# EasyEDA Pro project H723_AD9280_AD9708.eprj

# Schematic Schematic1
Board Name: Board1; Create Date: 2024-12-18; Page Name: P1; Project Name: H723_AD9280_AD9708; Schematic Name: Schematic1; Update Date: 2024-12-18; Company: 嘉立创EDA; Page Size: A4; Version: V1.0
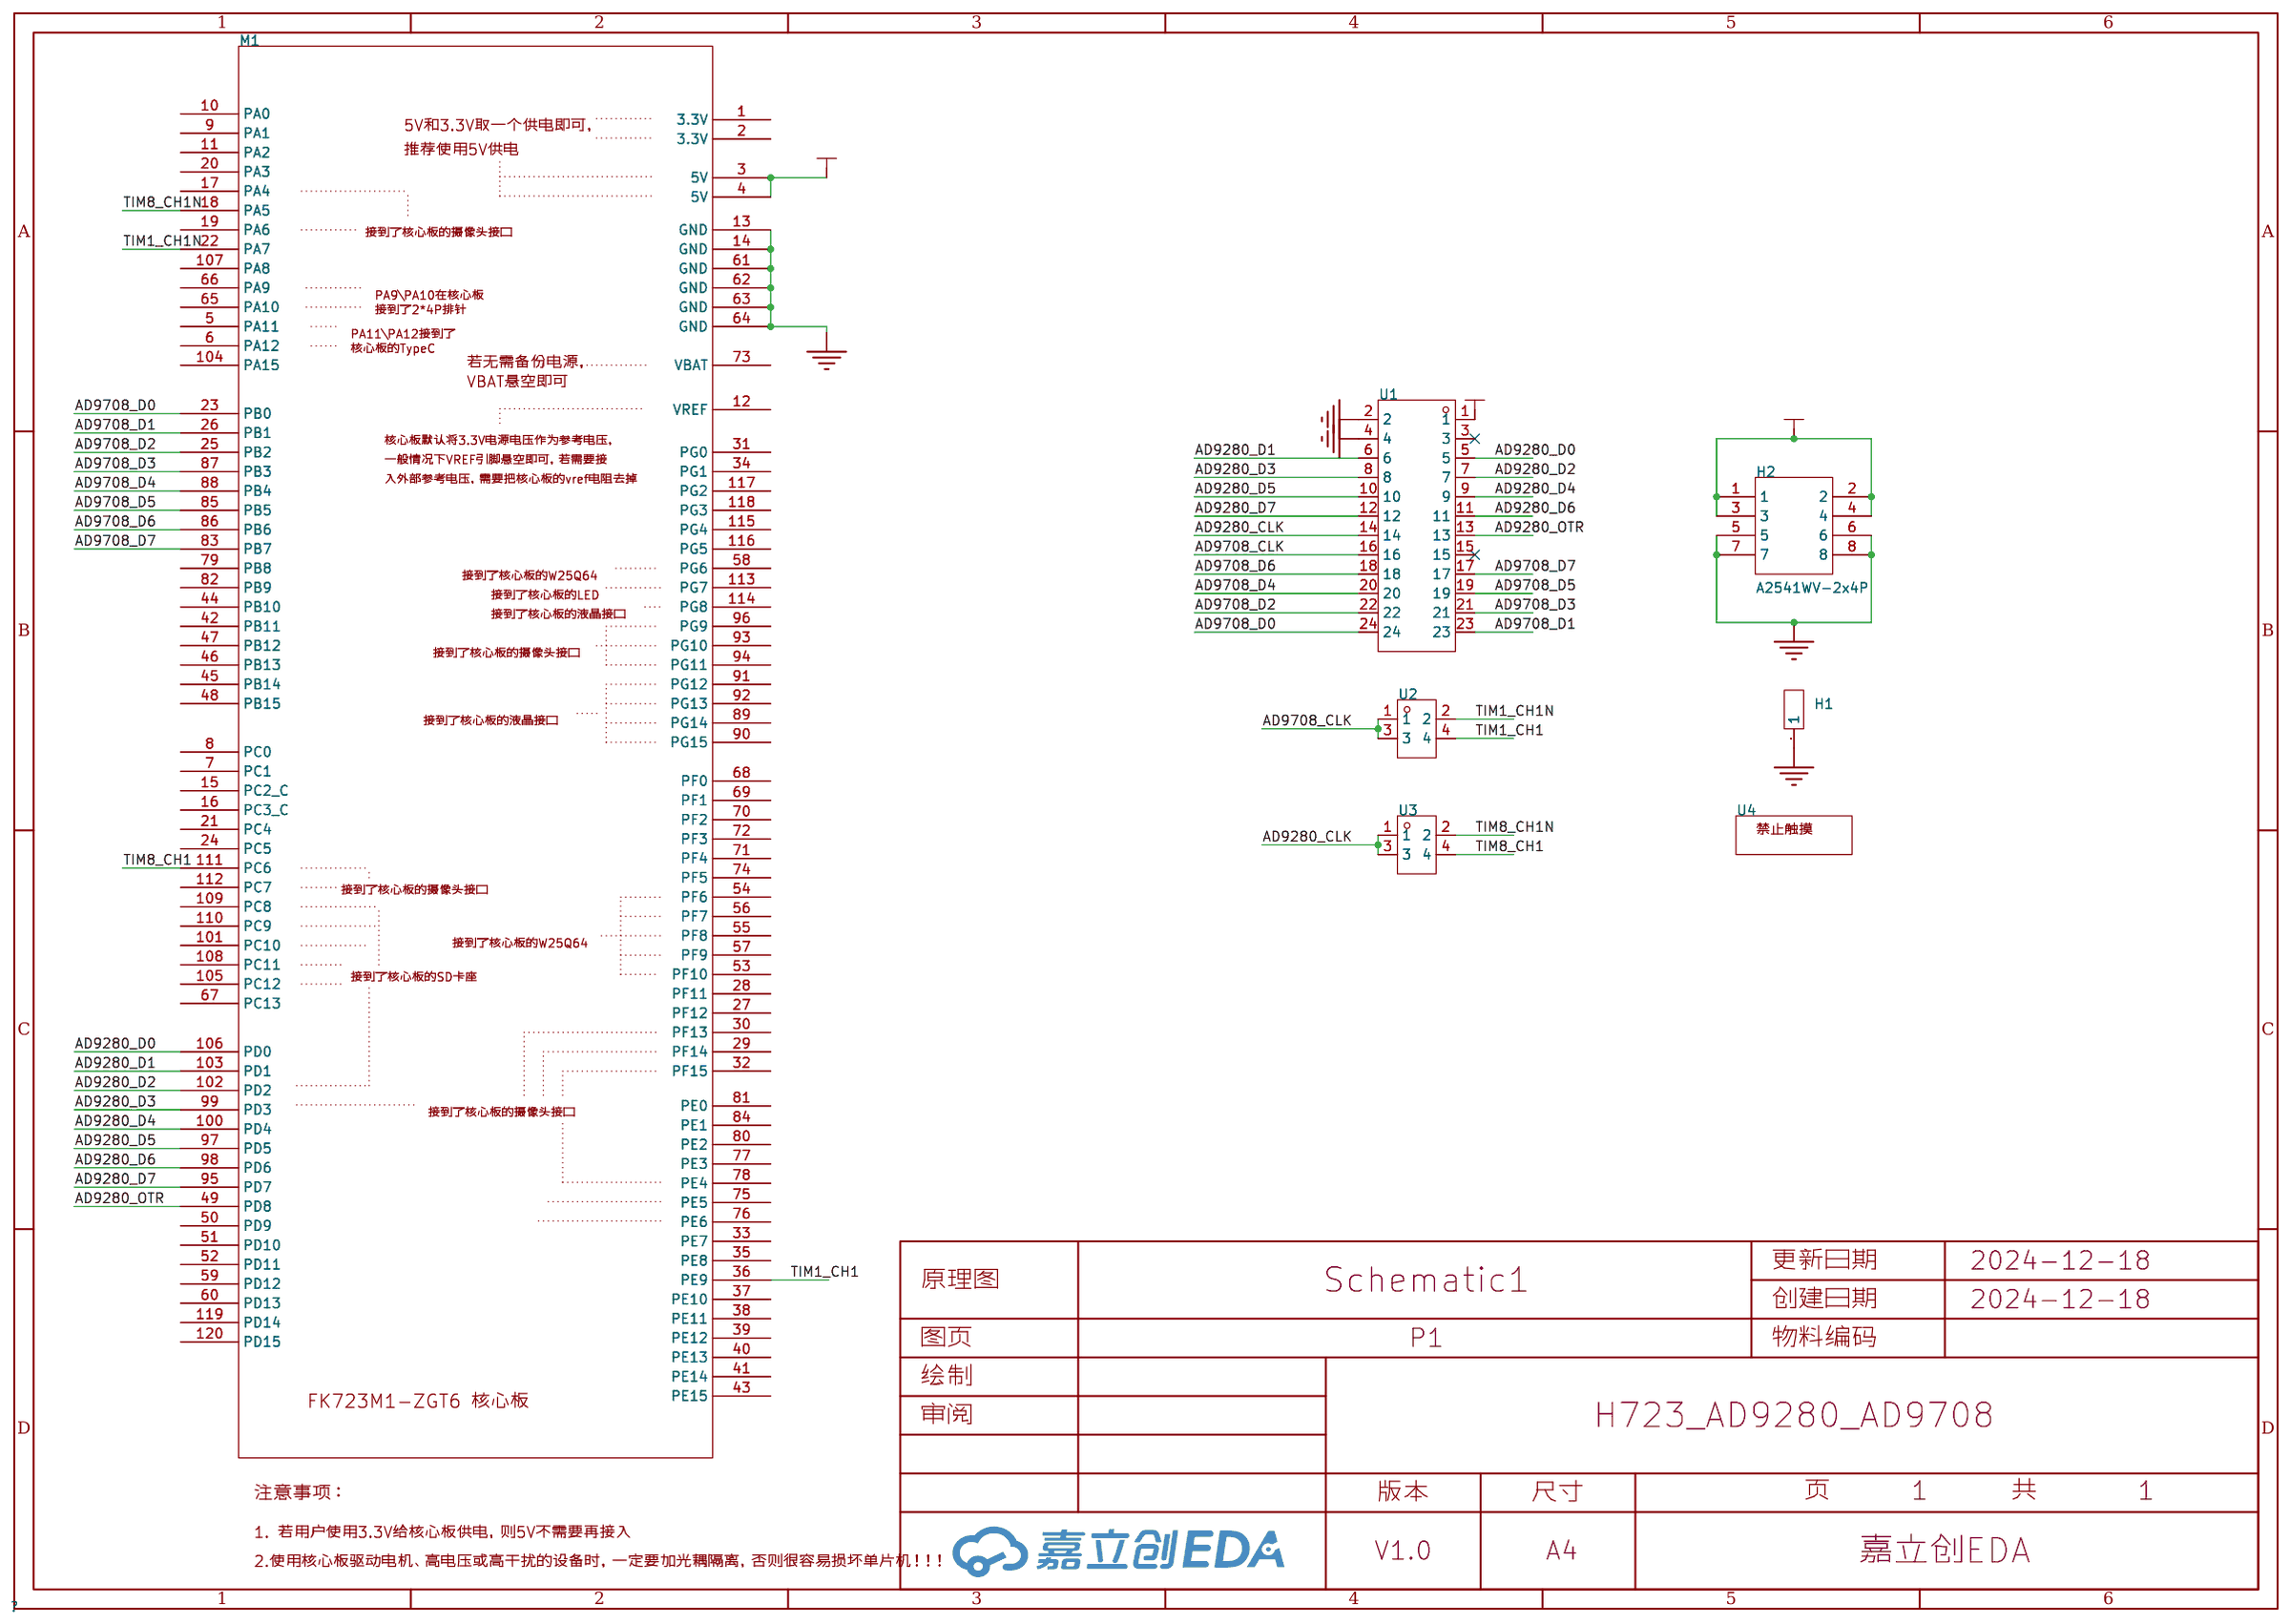
[diagram p0: schematic sheet]

## Parts
H1  -  [HDR-TH_1P-V-M_XKB_X4611WV-01I-C28D40]
H2  A2541WV-2x4P  [HDR-TH_8P-P2.54-V-R2-C4-S2.54_A2541WV-2X4P]
M1  -  [FK723M1-ZGT6]
U1  2541WV-2x12P  [HDR-TH_24P-P2.54-V-M-R2-C12-S2.54]
U2  2541WV-2x02P  [HDR-TH_4P-P2.54-V-M-R2-C2-S2.54]
U3  2541WV-2x02P  [HDR-TH_4P-P2.54-V-M-R2-C2-S2.54]
U4  -  [禁止触摸LOGO]

## Library data of the parts
H1 = HDR-M_2.54_1x1P: Supplier Part: C81276; Supplier Footprint: 插件; JLCPCB Part Class: Extended Part
H2 = A2541WV-2x4P: LCSC Part Name: 2x4P 间距:2.54mm 方针 直插; Supplier Part: C225519; Manufacturer: CJT(长江连接器); Supplier Footprint: 插件,P=2.54mm; JLCPCB Part Class: 扩展库; Datasheet: https://atta.szlcsc.com/upload/public/pdf/source/20180724/C239359_48B1BC0CA1B4E4396A63955AAFD15564.pdf; Supplier: LCSC; Pin Structure: 2x4P; Pitch: 2.54mm; Row Spacing: 2.54mm; Circluar Pins/Square Pins: 方针; Mounting Type: 直插; Number of Rows: 双排; Number of Pins: 8P; Current Rating (Max): 3A; Voltage Rating (Max): 250V; Length of Mating Pin: 6mm; Insulation Height: 2.54mm; Length of End Connection Pin: 3mm; Contact Material: 黄铜; Contact Plating: 金; Operating Temperature Range: -40℃~+105℃; Color: 黑色
M1 = FK723M1-ZGT6
U1 = 2541WV-2x12P: LCSC Part Name: 2x12P 间距:2.54mm 直插; Supplier Part: C5383110; Manufacturer: HanElectricity(瀚源); Supplier Footprint: 插件,P=2.54mm; JLCPCB Part Class: 扩展库; Datasheet: https://atta.szlcsc.com/upload/public/pdf/source/20230330/E6AE37B56C45D0CDA24B058754300644.pdf; Supplier: LCSC; Pin Structure: 2x12P; Pitch: 2.54mm; Mounting Type: 直插; Number of Rows: 双排; Number of Pins: 24P; Length of Mating Pin: 6mm; Insulation Height: 2.54mm; Length of End Connection Pin: 3mm
U2 U3 = 2541WV-2x02P: LCSC Part Name: 2x2P 间距:2.54mm 直插; Supplier Part: C5383103; Manufacturer: HanElectricity(瀚源); Supplier Footprint: 插件,P=2.54mm; JLCPCB Part Class: 扩展库; Datasheet: https://atta.szlcsc.com/upload/public/pdf/source/20230330/E6AE37B56C45D0CDA24B058754300644.pdf; Supplier: LCSC; Pin Structure: 2x2P; Pitch: 2.54mm; Mounting Type: 直插; Number of Rows: 双排; Number of Pins: 4P; Length of Mating Pin: 6mm; Insulation Height: 2.54mm; Length of End Connection Pin: 3mm
U4 = 禁止触摸LOGO

## Nets
5V: H2.1 H2.2 H2.3 H2.4 M1.3(5V) M1.4(5V) U1.1
GND: H1.1 H2.5 H2.6 H2.7 H2.8 M1.13(GND) M1.14(GND) M1.61(GND) M1.62(GND) M1.63(GND) M1.64(GND) U1.2 U1.4
AD9280_CLK: U1.14 U3.1 U3.3
AD9280_D0: M1.106(PD0) U1.5
AD9280_D1: M1.103(PD1) U1.6
AD9280_D2: M1.102(PD2) U1.7
AD9280_D3: M1.99(PD3) U1.8
AD9280_D4: M1.100(PD4) U1.9
AD9280_D5: M1.97(PD5) U1.10
AD9280_D6: M1.98(PD6) U1.11
AD9280_D7: M1.95(PD7) U1.12
AD9280_OTR: M1.49(PD8) U1.13
AD9708_CLK: U1.16 U2.1 U2.3
AD9708_D0: M1.23(PB0) U1.24
AD9708_D1: M1.26(PB1) U1.23
AD9708_D2: M1.25(PB2) U1.22
AD9708_D3: M1.87(PB3) U1.21
AD9708_D4: M1.88(PB4) U1.20
AD9708_D5: M1.85(PB5) U1.19
AD9708_D6: M1.86(PB6) U1.18
AD9708_D7: M1.83(PB7) U1.17
TIM1_CH1: M1.36(PE9) U2.4
TIM1_CH1N: M1.22(PA7) U2.2
TIM8_CH1: M1.111(PC6) U3.4
TIM8_CH1N: M1.18(PA5) U3.2

Not connected (* = marked no-connect by the designer): M1 1(3.3V) 2(3.3V) 5(PA11) 6(PA12) 7(PC1) 8(PC0) 9(PA1) 10(PA0) 11(PA2) 12(VREF) 15(PC2_C) 16(PC3_C) 17(PA4) 19(PA6) 20(PA3) 21(PC4) 24(PC5) 27(PF12) 28(PF11) 29(PF14) 30(PF13) 31(PG0) 32(PF15) 33(PE7) 34(PG1) 35(PE8) 37(PE10) 38(PE11) 39(PE12) 40(PE13) 41(PE14) 42(PB11) 43(PE15) 44(PB10) 45(PB14) 46(PB13) 47(PB12) 48(PB15) 50(PD9) 51(PD10) 52(PD11) 53(PF10) 54(PF6) 55(PF8) 56(PF7) 57(PF9) 58(PG6) 59(PD12) 60(PD13) 65(PA10) 66(PA9) 67(PC13) 68(PF0) 69(PF1) 70(PF2) 71(PF4) 72(PF3) 73(VBAT) 74(PF5) 75(PE5) 76(PE6) 77(PE3) 78(PE4) 79(PB8) 80(PE2) 81(PE0) 82(PB9) 84(PE1) 89(PG14) 90(PG15) 91(PG12) 92(PG13) 93(PG10) 94(PG11) 96(PG9) 101(PC10) 104(PA15) 105(PC12) 107(PA8) 108(PC11) 109(PC8) 110(PC9) 112(PC7) 113(PG7) 114(PG8) 115(PG4) 116(PG5) 117(PG2) 118(PG3) 119(PD14) 120(PD15); U1 3* 15*

# Board PCB1
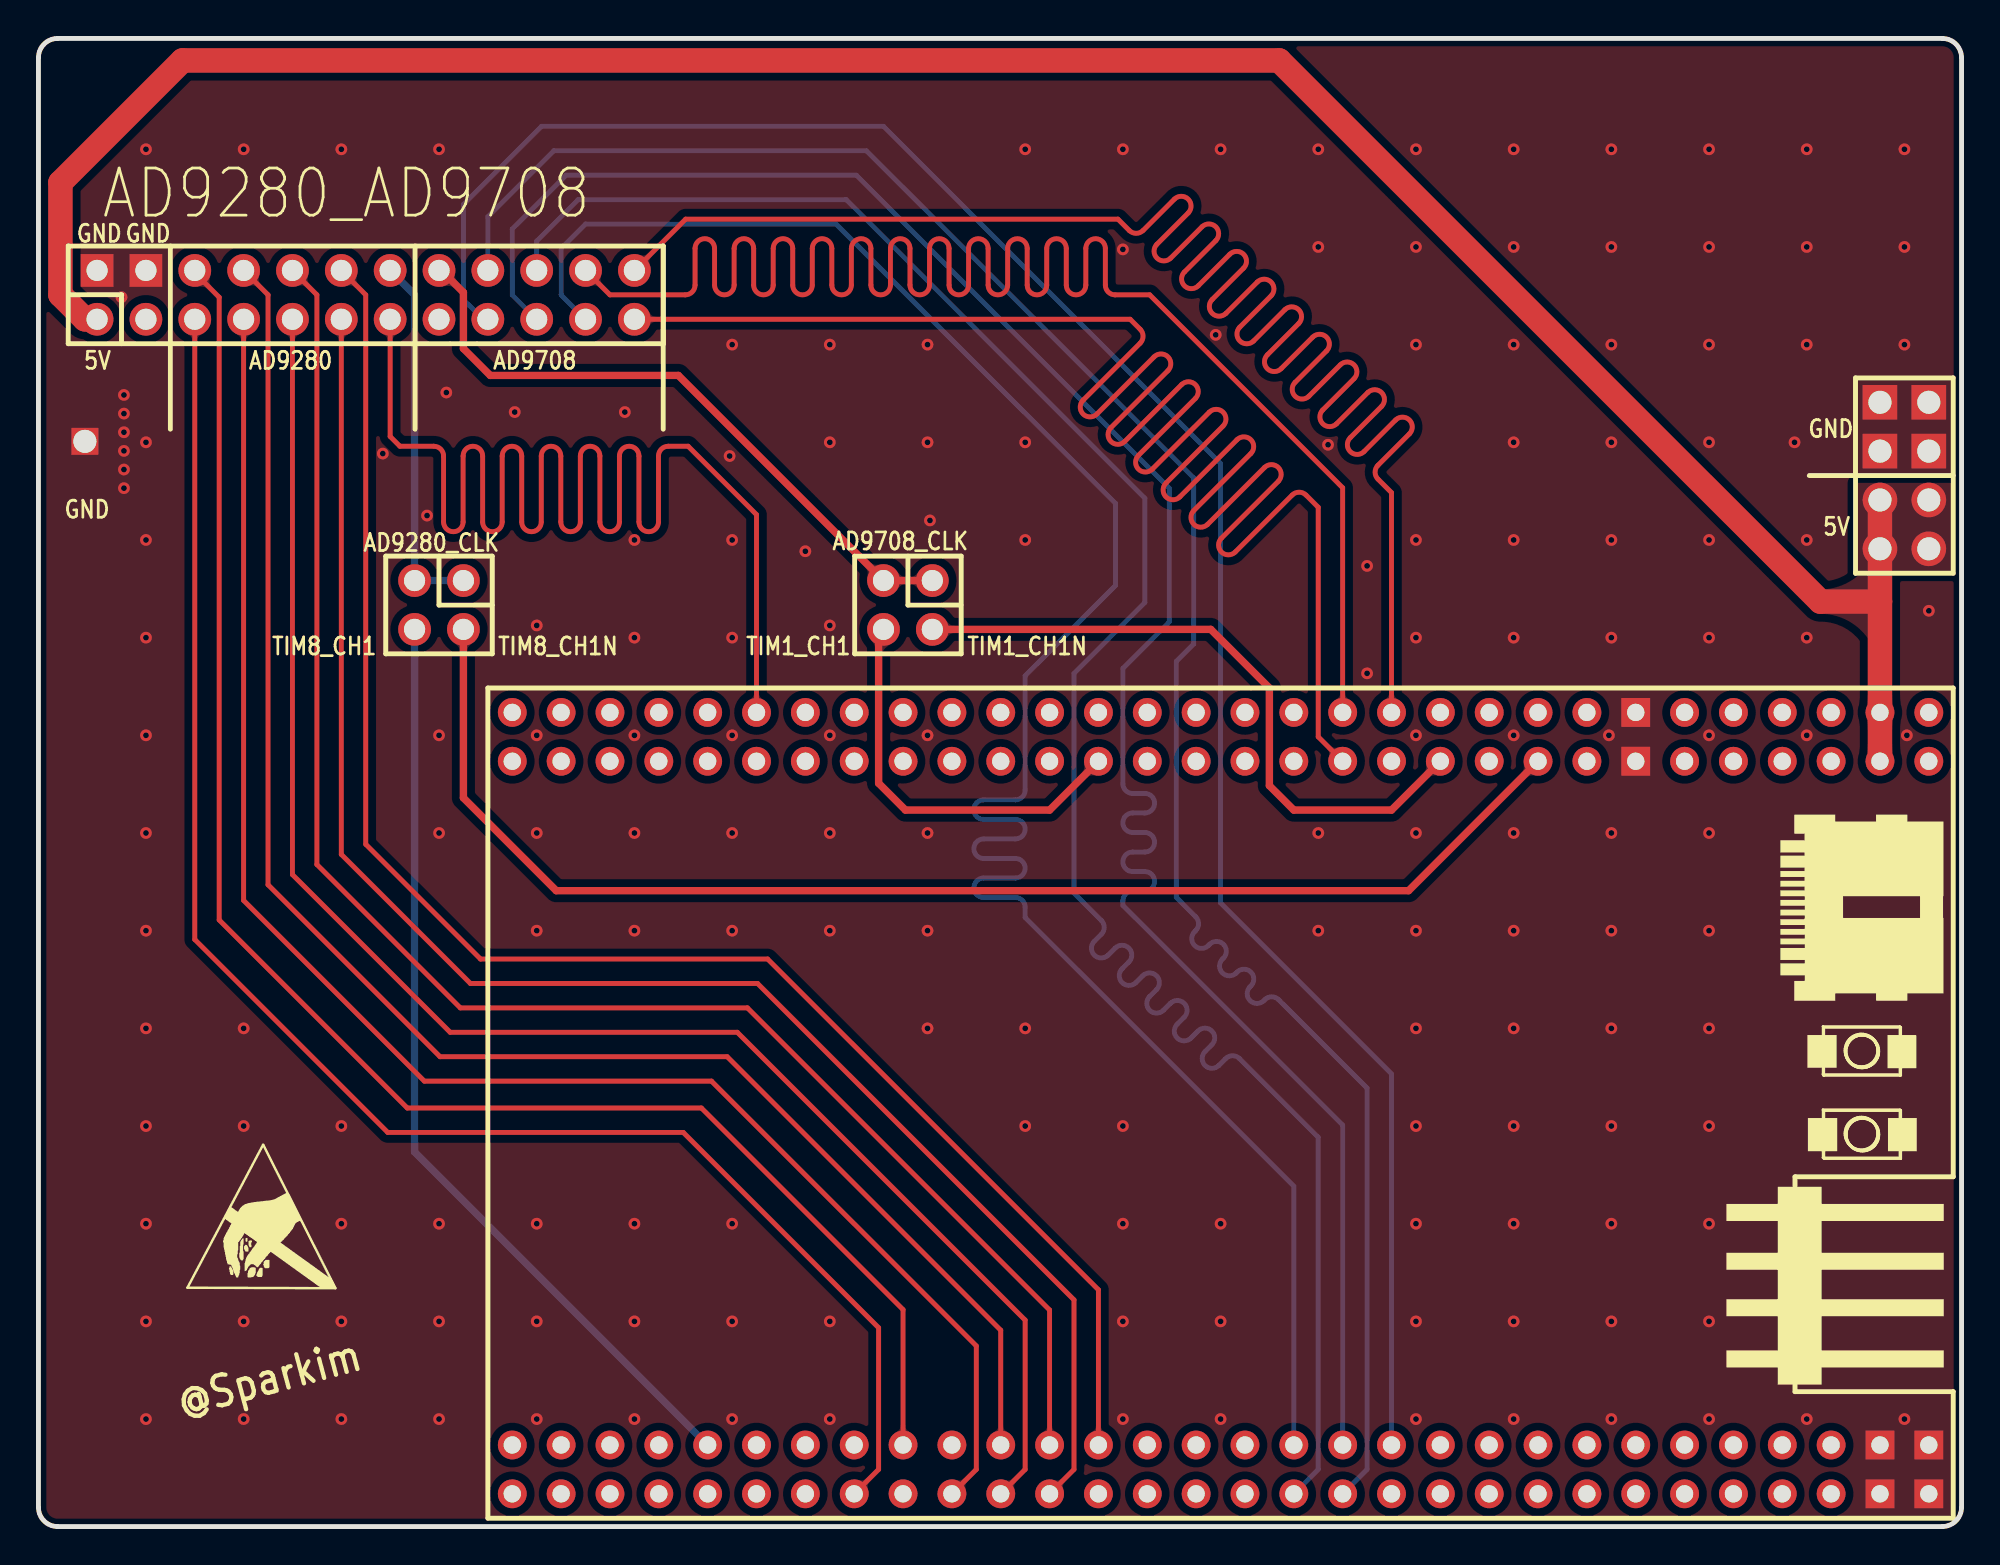
[diagram p1: board, top side]
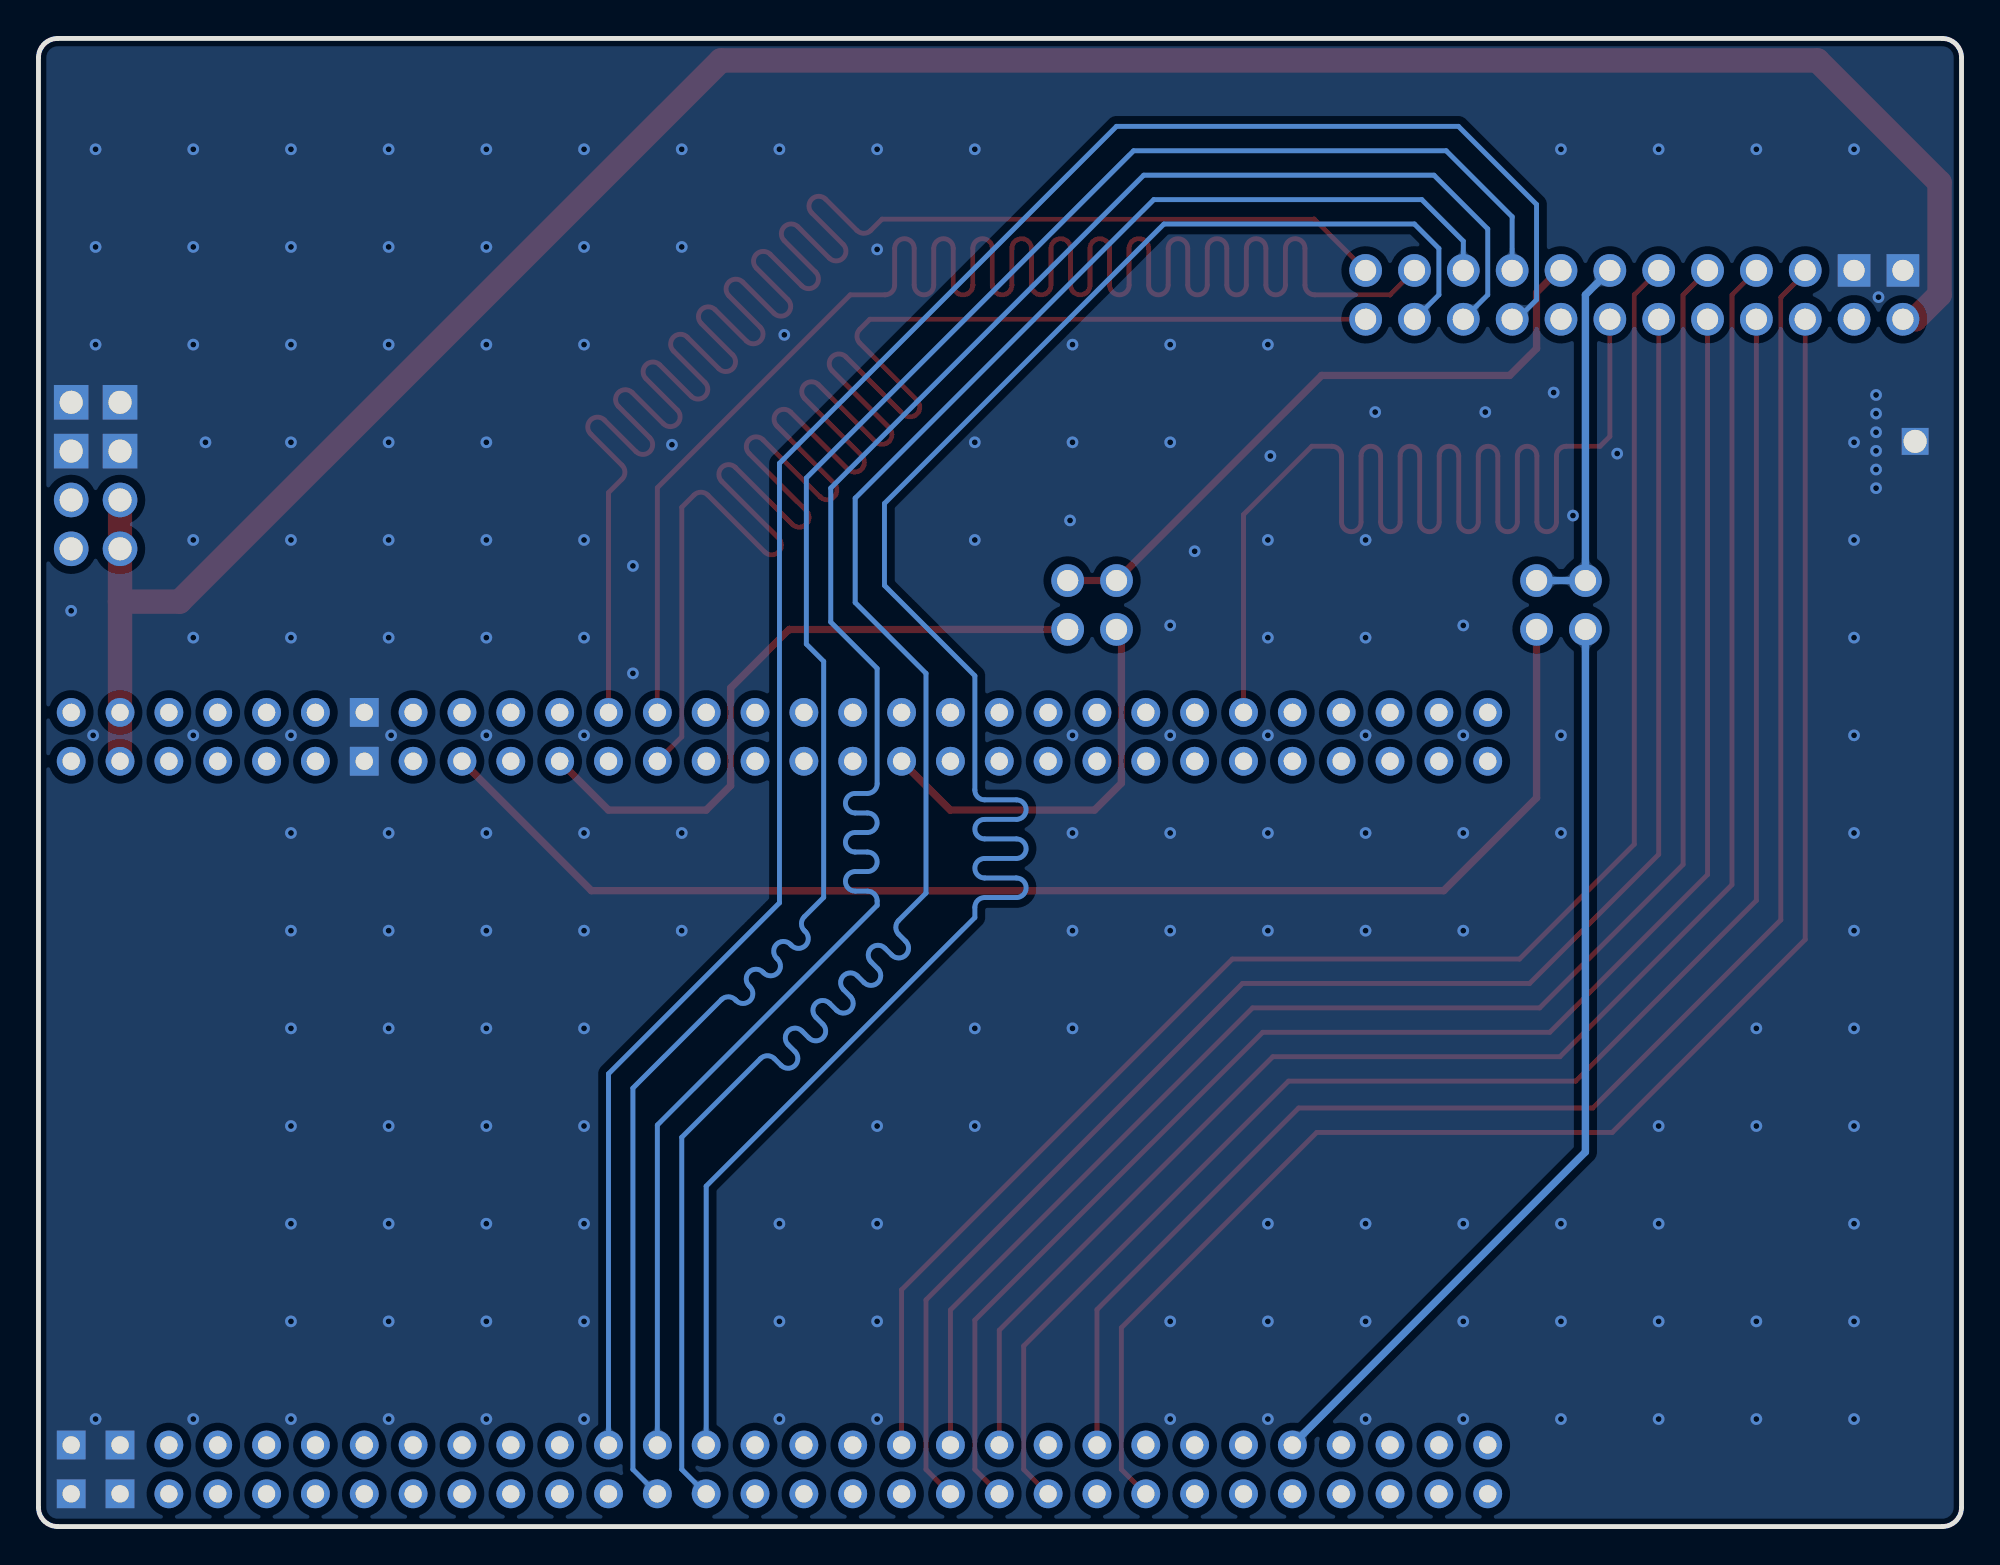
[diagram p2: board, bottom side, seen from below]

Outline 100 x 77.39 mm; copper layers: Top Layer, Bottom Layer. Coordinates in mm from the lower left corner of the outline.
Outline path: 0,76.39 0,1 arc(0.29,0.29) 1,0 99,0 arc(99.71,0.29) 100,1 100,76.39 arc(99.71,77.1) 99,77.39 1,77.39 arc(0.29,77.1) 0,76.39
Stack: Top Layer 0.035mm / Dielectric1 1.51mm FR4 er 4.5 / Bottom Layer 0.035mm

## Design rules (mm)
template: 自定义配置
spacing copperThickness1oz (default): track to track 0.102, other pairs 0.152 to 0.3
spacing copperThickness2oz: track to track 0.203, other pairs 0.152 to 0.3
track width copperThickness1oz (default): min 0.127, default 0.254, max 2.54
track width copperThickness2oz: min 0.203, default 0.254, max 2.54
differential pair differentialPair (default): width min 0.127, default 0.254, max 2.54; gap min 0.152, default 0.152
via viaSize (default): diameter min 0.5, default 0.61, max 10; hole min 0.3, default 0.305, max 6.299
net AD9708_D1 uses netLength2
net AD9708_D2 uses netLength2
net AD9708_D0 uses netLength2
net AD9280_OTR uses netLength1
net AD9708_D7 uses netLength2
net AD9708_D5 uses netLength2
net AD9708_D6 uses netLength2
net AD9708_D3 uses netLength2
net AD9708_D4 uses netLength2
net AD9280_D7 uses netLength1
net AD9280_D5 uses netLength1
net AD9280_D6 uses netLength1
net AD9280_D3 uses netLength1
net AD9280_D4 uses netLength1
net AD9280_D2 uses netLength1
net AD9280_D1 uses netLength1
net AD9280_D0 uses netLength1
eq len grp AD9280_D uses netLength1
eq len grp AD9708_D uses netLength2

## Placement (name value [footprint] x y rotation side)
H1  -  [HDR-TH_1P-V-M_XKB_X4611WV-01I-C28D40]  2.41 56.44 0 top
H2  A2541WV-2x4P  [HDR-TH_8P-P2.54-V-R2-C4-S2.54_A2541WV-2X4P]  97.03 54.66 90 top
M1  -  [FK723M1-ZGT6]  61.47 22.02 0 top
U1  2541WV-2x12P  [HDR-TH_24P-P2.54-V-M-R2-C12-S2.54]  17.02 64.06 0 top
U2  2541WV-2x02P  [HDR-TH_4P-P2.54-V-M-R2-C2-S2.54]  45.21 47.93 180 top
U3  2541WV-2x02P  [HDR-TH_4P-P2.54-V-M-R2-C2-S2.54]  20.83 47.93 180 top
U4  -  [禁止触摸LOGO]  11.68 15.29 0 top

## Footprints (pads in the part's own frame, mm; a bottom-side part is the same pattern mirrored in y, then rotated)
FK723M1-ZGT6
  round 1.5 hole 0.9: 1(36.83,20.32) 2(36.83,17.78) 3(34.29,20.32) 4(34.29,17.78) 5(31.75,20.32) 6(31.75,17.78) 7(29.21,20.32) 8(29.21,17.78) 9(26.67,20.32) 10(26.67,17.78) 11(24.13,20.32) 12(24.13,17.78) 15(19.05,20.32) 16(19.05,17.78) 17(16.51,20.32) 18(16.51,17.78) 19(13.97,20.32) 20(13.97,17.78) 21(11.43,20.32) 22(11.43,17.78) 23(8.89,20.32) 24(8.89,17.78) 25(6.35,20.32) 26(6.35,17.78) 27(3.81,20.32) 28(3.81,17.78) 29(1.27,20.32) 30(1.27,17.78) 31(-1.27,20.32) 32(-1.27,17.78) 33(-3.81,20.32) 34(-3.81,17.78) 35(-6.35,20.32) 36(-6.35,17.78) 37(-8.89,20.32) 38(-8.89,17.78) 39(-11.43,20.32) 40(-11.43,17.78) 41(-13.97,20.32) 42(-13.97,17.78) 43(-16.51,20.32) 44(-16.51,17.78) 45(-19.05,20.32) 46(-19.05,17.78) 47(-21.59,20.32) 48(-21.59,17.78) 49(-24.13,20.32) 50(-24.13,17.78) 51(-26.67,20.32) 52(-26.67,17.78) 53(-29.21,20.32) 54(-29.21,17.78) 55(-31.75,20.32) 56(-31.75,17.78) 57(-34.29,20.32) 58(-34.29,17.78) 59(-36.83,20.32) 60(-36.83,17.78) 65(31.75,-17.78) 66(31.75,-20.32) 67(29.21,-17.78) 68(29.21,-20.32) 69(26.67,-17.78) 70(26.67,-20.32) 71(24.13,-17.78) 72(24.13,-20.32) 73(21.59,-17.78) 74(21.59,-20.32) 75(19.05,-17.78) 76(19.05,-20.32) 77(16.51,-17.78) 78(16.51,-20.32) 79(13.97,-17.78) 80(13.97,-20.32) 81(11.43,-17.78) 82(11.43,-20.32) 83(8.89,-17.78) 84(8.89,-20.32) 85(6.35,-17.78) 86(6.35,-20.32) 87(3.81,-17.78) 88(3.81,-20.32) 89(1.27,-17.78) 90(1.27,-20.32) 91(-1.27,-17.78) 92(-1.27,-20.32) 93(-3.81,-17.78) 94(-3.81,-20.32) 95(-6.35,-17.78) 96(-6.35,-20.32) 97(-8.89,-17.78) 98(-8.89,-20.32) 99(-11.43,-17.78) 100(-11.43,-20.32) 101(-13.97,-17.78) 102(-13.97,-20.32) 103(-16.51,-17.78) 104(-16.51,-20.32) 105(-19.05,-17.78) 106(-19.05,-20.32) 107(-21.59,-17.78) 108(-21.59,-20.32) 109(-24.13,-17.78) 110(-24.13,-20.32) 111(-26.67,-17.78) 112(-26.67,-20.32) 113(-29.21,-17.78) 114(-29.21,-20.32) 115(-31.75,-17.78) 116(-31.75,-20.32) 117(-34.29,-17.78) 118(-34.29,-20.32) 119(-36.83,-17.78) 120(-36.83,-20.32)
  rect 1.5x1.5 hole 0.9: 13(21.59,20.32) 14(21.59,17.78) 61(36.83,-17.78) 62(36.83,-20.32) 63(34.29,-17.78) 64(34.29,-20.32)
HDR-TH_1P-V-M_XKB_X4611WV-01I-C28D40
  rect 1.4x1.4 hole 1.2: 1(0,0)
HDR-TH_4P-P2.54-V-M-R2-C2-S2.54
  round 1.7 hole 1.1: 1(-1.27,-1.27) 2(-1.27,1.27) 3(1.27,-1.27) 4(1.27,1.27)
HDR-TH_8P-P2.54-V-R2-C4-S2.54_A2541WV-2X4P
  round 1.8 hole 1.2: 1(-3.81,-1.27) 2(-3.81,1.27) 3(-1.27,-1.27) 4(-1.27,1.27)
  rect 1.8x1.8 hole 1.2: 5(1.27,-1.27) 6(1.27,1.27) 7(3.81,-1.27) 8(3.81,1.27)
HDR-TH_24P-P2.54-V-M-R2-C12-S2.54
  round 1.7 hole 1.1: 1(-13.97,-1.27) 3(-11.43,-1.27) 5(-8.89,-1.27) 6(-8.89,1.27) 7(-6.35,-1.27) 8(-6.35,1.27) 9(-3.81,-1.27) 10(-3.81,1.27) 11(-1.27,-1.27) 12(-1.27,1.27) 13(1.27,-1.27) 14(1.27,1.27) 15(3.81,-1.27) 16(3.81,1.27) 17(6.35,-1.27) 18(6.35,1.27) 19(8.89,-1.27) 20(8.89,1.27) 21(11.43,-1.27) 22(11.43,1.27) 23(13.97,-1.27) 24(13.97,1.27)
  rect 1.7x1.7 hole 1.1: 2(-13.97,1.27) 4(-11.43,1.27)

## Nets
As in the schematic.

Pads without a net: M1 1 2 5 6 7 8 9 10 11 12 15 16 17 19 20 21 24 27 28 29 30 31 32 33 34 35 37 38 39 40 41 42 43 44 45 46 47 48 50 51 52 53 54 55 56 57 58 59 60 65 66 67 68 69 70 71 72 73 74 75 76 77 78 79 80 81 82 84 89 90 91 92 93 94 96 101 104 105 107 108 109 110 112 113 114 115 116 117 118 119 120; U1 3 15

## Via types
v1: diameter 0.61, hole 0.305, Top Layer to Bottom Layer, 173 vias

## Routing (per net, layer and track width the routed paths; a pad name or vN(x,y) marks a point on that pad's centre or on a via; arc(x,y) is an arc through that point)
5V: length 130.8
  Top Layer w1.27: M1.4 M1.3 95.76,48.1 ; U1.1 2.41,62.79 1.14,64.06 1.14,69.9 7.49,76.25 64.52,76.25 92.66,48.1 95.76,48.1 ; 95.76,48.1 H2.2 H2.4
GND:
  vias: v1(4.32,63.94) v1(4.44,58.85) v1(4.44,57.88) v1(4.44,56.91) v1(4.44,55.94) v1(4.44,54.97) v1(4.44,54.01) v1(5.59,71.63) v1(5.59,56.39) v1(5.59,51.31) v1(5.59,46.23) v1(5.59,41.15) v1(5.59,36.07) v1(5.59,30.99) v1(5.59,25.91) v1(5.59,20.83) v1(5.59,15.75) v1(5.59,10.67) v1(5.59,5.59) v1(10.67,71.63) v1(10.67,25.91) v1(10.67,20.83) v1(10.67,10.67) v1(10.67,5.59) v1(15.75,71.63) v1(15.75,20.83) v1(15.75,15.75) v1(15.75,10.67) v1(15.75,5.59) v1(17.91,55.8) v1(20.21,52.58) v1(20.83,71.63) v1(20.83,41.15) v1(20.83,36.07) v1(20.83,15.75) v1(20.83,10.67) v1(20.83,5.59) v1(21.21,58.98) v1(24.77,57.96) v1(25.91,46.87) v1(25.91,41.15) v1(25.91,36.07) v1(25.91,30.99) v1(25.91,15.75) v1(25.91,10.67) v1(25.91,5.59) v1(30.49,57.96) v1(30.99,51.31) v1(30.99,46.23) v1(30.99,41.15) v1(30.99,36.07) v1(30.99,30.99) v1(30.99,15.75) v1(30.99,10.67) v1(30.99,5.59) v1(35.94,55.68) v1(36.07,61.47) v1(36.07,51.31) v1(36.07,46.23) v1(36.07,41.15) v1(36.07,36.07) v1(36.07,30.99) v1(36.07,15.75) v1(36.07,10.67) v1(36.07,5.59) v1(39.88,50.72) v1(41.15,61.47) v1(41.15,56.39) v1(41.15,46.87) v1(41.15,41.15) v1(41.15,36.07) v1(41.15,30.99) v1(41.15,10.67) v1(41.15,5.59) v1(46.23,61.47) v1(46.23,56.39) v1(46.23,41.15) v1(46.23,36.07) v1(46.23,30.99) v1(46.23,25.91) v1(46.36,52.33) v1(51.31,71.63) v1(51.31,56.39) v1(51.31,51.31) v1(51.31,25.91) v1(51.31,20.83) v1(56.39,71.63) v1(56.39,66.42) v1(56.39,20.83) v1(56.39,15.75) v1(56.39,10.67) v1(56.39,5.59) v1(61.22,61.98) v1(61.47,71.63) v1(61.47,15.75) v1(61.47,10.67) v1(61.47,5.59) v1(66.55,71.63) v1(66.55,66.55) v1(66.55,36.07) v1(66.55,30.99) v1(67.06,56.26) v1(69.09,49.96) v1(69.09,44.37) v1(71.63,71.63) v1(71.63,66.55) v1(71.63,61.47) v1(71.63,51.31) v1(71.63,46.23) v1(71.63,41.15) v1(71.63,36.07) v1(71.63,30.99) v1(71.63,25.91) v1(71.63,20.83) v1(71.63,15.75) v1(71.63,10.67) v1(71.63,5.59) v1(76.71,71.63) v1(76.71,66.55) v1(76.71,61.47) v1(76.71,56.39) v1(76.71,51.31) v1(76.71,46.23) v1(76.71,41.15) v1(76.71,36.07) v1(76.71,30.99) v1(76.71,25.91) v1(76.71,20.83) v1(76.71,15.75) v1(76.71,10.67) v1(76.71,5.59) v1(81.66,41.15) v1(81.79,71.63) v1(81.79,66.55) v1(81.79,61.47) v1(81.79,56.39) v1(81.79,51.31) v1(81.79,46.23) v1(81.79,36.07) v1(81.79,30.99) v1(81.79,25.91) v1(81.79,20.83) v1(81.79,15.75) v1(81.79,10.67) v1(81.79,5.59) v1(86.87,71.63) v1(86.87,66.55) v1(86.87,61.47) v1(86.87,56.39) v1(86.87,51.31) v1(86.87,46.23) v1(86.87,41.15) v1(86.87,36.07) v1(86.87,30.99) v1(86.87,25.91) v1(86.87,20.83) v1(86.87,15.75) v1(86.87,10.67) v1(86.87,5.59) v1(91.32,56.39) v1(91.95,71.63) v1(91.95,66.55) v1(91.95,61.47) v1(91.95,51.31) v1(91.95,46.23) v1(91.95,41.15) v1(91.95,5.59) v1(97.03,71.63) v1(97.03,66.55) v1(97.03,61.47) v1(97.03,5.59) v1(97.16,41.15) v1(98.3,47.63)
AD9280_CLK: length 19.2
  Bottom Layer w0.381: U1.14 19.56,64.06 U3.3 U3.1
AD9280_D0: length 85.3
  Top Layer w0.254: M1.106 43.69,2.97 43.69,10.34 33.53,20.5 18.16,20.5 8.13,30.53 U1.5
AD9280_D1: length 85.3
  Top Layer w0.254: U1.6 8.13,65.2 9.4,63.93 9.4,31.55 19.18,21.77 34.47,21.77 44.96,11.28 M1.103
AD9280_D2: length 86.1
  Top Layer w0.254: M1.102 48.77,2.97 48.77,9.39 35,23.17 20.07,23.17 10.67,32.56 U1.7
AD9280_D3: length 86.1
  Top Layer w0.254: U1.8 11.94,64.06 11.94,33.38 20.88,24.44 35.81,24.44 50.04,10.21 M1.99
AD9280_D4: length 86.1
  Top Layer w0.254: M1.100 51.31,2.97 51.31,10.74 36.34,25.7 21.41,25.7 13.21,33.91 U1.9
AD9280_D5: length 86.1
  Top Layer w0.254: U1.10 14.48,64.06 14.48,34.43 21.94,26.97 36.87,26.97 52.58,11.26 M1.97
AD9280_D6: length 86.1
  Top Layer w0.254: U1.11 15.75,34.96 22.46,28.25 37.39,28.25 53.85,11.79 53.85,2.97 M1.98
AD9280_D7: length 86.1
  Top Layer w0.254: U1.12 17.02,64.06 17.02,35.48 22.99,29.52 37.92,29.52 55.12,12.31 M1.95
AD9280_OTR: length 85.2
  Top Layer w0.254: U1.13 18.29,56.69 18.8,56.19 20.56,56.19 arc(20.92,56.04) 21.07,55.68 21.07,52.25 arc(21.57,51.74) 22.08,52.25 22.08,55.68 arc(22.59,56.19) 23.1,55.68 23.1,52.25 arc(23.61,51.74) 24.11,52.25 24.11,55.68 arc(24.62,56.19) 25.13,55.68 25.13,52.25 arc(25.64,51.74) 26.15,52.25 26.15,55.68 arc(26.65,56.19) 27.16,55.68 27.16,52.25 arc(27.67,51.74) 28.18,52.25 28.18,55.68 arc(28.69,56.19) 29.19,55.68 29.19,52.25 arc(29.7,51.74) 30.21,52.25 30.21,55.68 arc(30.72,56.19) 31.23,55.68 31.23,52.25 arc(31.73,51.74) 32.24,52.25 32.24,55.68 arc(32.39,56.04) 32.75,56.19 33.78,56.19 37.34,52.63 M1.49
AD9708_CLK: length 34
  Top Layer w0.381: U1.16 20.95,65.33 22.1,64.19 22.1,61.27 23.5,59.87 33.27,59.87 U2.3 U2.1
AD9708_D0: length 109.8
  Top Layer w0.254: U1.24 33.66,68 56.13,68 56.72,67.41 arc(57.08,67.26) 57.44,67.41 59.07,69.04 arc(59.79,69.04) 59.79,68.32 58.16,66.69 arc(58.16,65.97) 58.88,65.97 60.51,67.6 arc(61.23,67.6) 61.23,66.88 59.6,65.25 arc(59.6,64.53) 60.31,64.53 61.94,66.17 arc(62.66,66.17) 62.66,65.45 61.03,63.82 arc(61.03,63.1) 61.75,63.1 63.38,64.73 arc(64.1,64.73) 64.1,64.01 62.47,62.38 arc(62.47,61.66) 63.19,61.66 64.82,63.29 arc(65.54,63.29) 65.54,62.57 63.91,60.94 arc(63.91,60.22) 64.62,60.22 66.26,61.86 arc(66.97,61.86) 66.97,61.14 65.34,59.51 arc(65.34,58.79) 66.06,58.79 67.69,60.42 arc(68.41,60.42) 68.41,59.7 66.78,58.07 arc(66.78,57.35) 67.5,57.35 69.13,58.98 arc(69.85,58.98) 69.85,58.26 68.22,56.63 arc(68.22,55.91) 68.94,55.91 70.57,57.54 arc(71.28,57.55) 71.28,56.83 69.65,55.19 arc(69.5,54.84) 69.65,54.48 70.36,53.77 M1.23
AD9708_D1: length 110.6
  Top Layer w0.254: M1.26 66.55,41.07 66.55,53.01 65.91,53.65 arc(65.55,53.8) 65.19,53.65 62.23,50.68 arc(61.51,50.68) 61.51,51.4 64.47,54.36 arc(64.47,55.08) 63.76,55.08 60.79,52.12 arc(60.07,52.12) 60.07,52.84 63.04,55.8 arc(63.04,56.52) 62.32,56.52 59.35,53.56 arc(58.64,53.56) 58.64,54.27 61.6,57.24 arc(61.6,57.96) 60.88,57.96 57.92,54.99 arc(57.2,54.99) 57.2,55.71 60.16,58.68 arc(60.16,59.39) 59.45,59.39 56.48,56.43 arc(55.76,56.43) 55.76,57.15 58.73,60.11 arc(58.73,60.83) 58.01,60.83 55.04,57.87 arc(54.33,57.87) 54.33,58.58 57.29,61.55 arc(57.44,61.91) 57.29,62.27 56.77,62.79 U1.23
AD9708_D2: length 110.4
  Top Layer w0.254: M1.25 67.82,54.03 57.78,64.06 55.99,64.06 arc(55.63,64.21) 55.48,64.57 55.48,66.47 arc(54.97,66.98) 54.46,66.47 54.46,64.57 arc(53.95,64.06) 53.45,64.57 53.45,66.47 arc(52.94,66.98) 52.43,66.47 52.43,64.57 arc(51.92,64.06) 51.41,64.57 51.41,66.47 arc(50.91,66.98) 50.4,66.47 50.4,64.57 arc(49.89,64.06) 49.38,64.57 49.38,66.47 arc(48.87,66.98) 48.37,66.47 48.37,64.57 arc(47.86,64.06) 47.35,64.57 47.35,66.47 arc(46.84,66.98) 46.33,66.47 46.33,64.57 arc(45.83,64.06) 45.32,64.57 45.32,66.47 arc(44.81,66.98) 44.3,66.47 44.3,64.57 arc(43.79,64.06) 43.29,64.57 43.29,66.47 arc(42.78,66.98) 42.27,66.47 42.27,64.57 arc(41.76,64.06) 41.25,64.57 41.25,66.47 arc(40.75,66.98) 40.24,66.47 40.24,64.57 arc(39.73,64.06) 39.22,64.57 39.22,66.47 arc(38.71,66.98) 38.21,66.47 38.21,64.57 arc(37.7,64.06) 37.19,64.57 37.19,66.47 arc(36.68,66.98) 36.17,66.47 36.17,64.57 arc(35.67,64.06) 35.16,64.57 35.16,66.47 arc(34.65,66.98) 34.14,66.47 34.14,64.57 arc(33.99,64.21) 33.63,64.06 29.72,64.06 U1.22
AD9708_D3: length 109.7
  Bottom Layer w0.254: M1.87 65.28,17.7 51.31,31.67 51.31,32.21 arc(51.16,32.57) 50.8,32.71 49.15,32.71 arc(48.64,33.22) 49.15,33.73 50.8,33.73 arc(51.31,34.24) 50.8,34.75 49.15,34.75 arc(48.64,35.25) 49.15,35.76 50.8,35.76 arc(51.31,36.27) 50.8,36.78 49.15,36.78 arc(48.64,37.29) 49.15,37.79 50.8,37.79 arc(51.16,37.94) 51.31,38.3 51.31,44.25 56.01,48.95 56.01,53.21 41.47,67.74 28.45,67.74 27.18,66.47 27.18,64.06 U1.21
AD9708_D4: length 110.5
  Bottom Layer w0.254: M1.88 66.55,2.97 66.55,20.24 62.45,24.34 arc(62.09,24.49) 61.74,24.34 61.37,23.98 arc(60.66,23.98) 60.66,24.7 61.02,25.06 arc(61.02,25.78) 60.3,25.78 59.94,25.41 arc(59.22,25.41) 59.22,26.13 59.58,26.49 arc(59.58,27.21) 58.86,27.21 58.5,26.85 arc(57.78,26.85) 57.78,27.57 58.14,27.93 arc(58.14,28.65) 57.43,28.65 57.06,28.29 arc(56.35,28.29) 56.35,29.01 56.71,29.37 arc(56.71,30.09) 55.99,30.09 55.63,29.72 arc(54.91,29.72) 54.91,30.44 55.27,30.8 arc(55.42,31.16) 55.27,31.52 53.85,32.94 53.85,44.37 57.53,48.06 57.53,53.48 42,69.01 28.07,69.01 25.91,66.85 U1.20
AD9708_D5: length 110.1
  Bottom Layer w0.254: U1.19 24.64,64.06 24.64,67.49 27.43,70.28 42.53,70.28 58.8,54.01 58.8,47.04 56.39,44.63 56.39,38.64 arc(56.54,38.28) 56.9,38.13 57.53,38.13 arc(58.04,37.62) 57.53,37.11 56.9,37.11 arc(56.39,36.61) 56.9,36.1 57.53,36.1 arc(58.04,35.59) 57.53,35.08 56.9,35.08 arc(56.39,34.57) 56.9,34.06 57.53,34.06 arc(58.04,33.56) 57.53,33.05 56.9,33.05 arc(56.54,32.9) 56.39,32.54 56.39,32.31 67.82,20.88 M1.85
AD9708_D6: length 109.7
  Bottom Layer w0.254: U1.18 23.37,68.12 26.8,71.55 43.05,71.55 60.07,54.53 60.07,45.9 59.17,45 59.17,32.72 60.18,31.71 arc(60.33,31.35) 60.18,31 60.12,30.94 arc(60.12,30.22) 60.84,30.22 60.9,30.28 arc(61.61,30.28) 61.61,29.56 61.56,29.51 arc(61.56,28.79) 62.28,28.79 62.33,28.84 arc(63.05,28.84) 63.05,28.12 63,28.07 arc(63,27.35) 63.72,27.35 63.77,27.4 arc(64.13,27.55) 64.49,27.4 69.09,22.8 69.09,2.97 M1.86
AD9708_D7: length 109.7
  Bottom Layer w0.254: U1.17 23.11,62.79 22.1,63.81 22.1,68.76 26.16,72.82 43.94,72.82 61.47,55.3 61.47,32.44 70.36,23.55 M1.83
TIM1_CH1: length 21.2
  Top Layer w0.381: U2.4 43.69,46.41 43.69,38.66 45.09,37.26 52.58,37.26 M1.36
TIM1_CH1N: length 34.3
  Top Layer w0.381: M1.22 70.36,37.26 65.28,37.26 64.01,38.53 64.01,43.61 60.96,46.66 U2.2
TIM8_CH1: length 48.7
  Bottom Layer w0.381: M1.111 19.56,19.48 U3.4
TIM8_CH1N: length 69.4
  Top Layer w0.381: M1.18 71.25,33.07 26.92,33.07 22.1,37.9 U3.2

## Copper pours and planes (outline as drawn; the poured copper is in the pictures)
5V on Top Layer: 94.49,54.28 99.57,54.28 99.57,49.58 94.49,49.58
GND on Top Layer: -10.67,88.06 110.49,88.06 110.49,-6.81 -10.67,-6.81
GND on Bottom Layer: -6.48,81.46 117.47,81.46 117.47,-18.11 -6.48,-18.11

Small or netless copper shapes (teardrops, artwork), in the pictures only: 42 on Top Layer, 16 on Bottom Layer

## Text on the board
Top Silkscreen Layer: GND | 5V | AD9280 | TIM8_CH1 | AD9280_CLK | AD9708 | TIM8_CH1N | TIM1_CH1 | AD9708_CLK | TIM1_CH1N | @Sparkim | AD9280_AD9708
